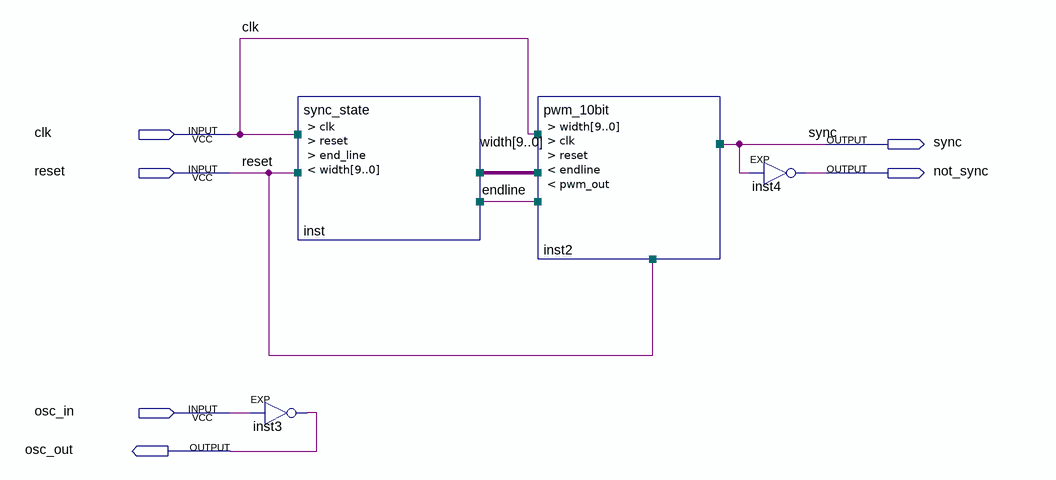
[diagram p0: schematic sheet]
// Quartus schematic Sync_Main.bdf as structural Verilog: 4 symbols, 6 pins
module Sync_Main (
  input  clk,
  input  reset,
  input  osc_in,
  output sync,
  output not_sync,
  output osc_out
);

  wire endline;
  wire [9:0] width;

  sync_state inst (.clk(clk), .reset(reset), .end_line(endline), .width(width));
  EXP inst3 (.IN(osc_in), .OUT(osc_out));
  pwm_10bit inst2 (.width(width), .clk(clk), .reset(reset), .endline(endline), .pwm_out(sync));
  EXP inst4 (.IN(sync), .OUT(not_sync));
endmodule
